# Altium schematic sheet CF_ESP32_S3_CAM_BOARD.SchDoc
size A3
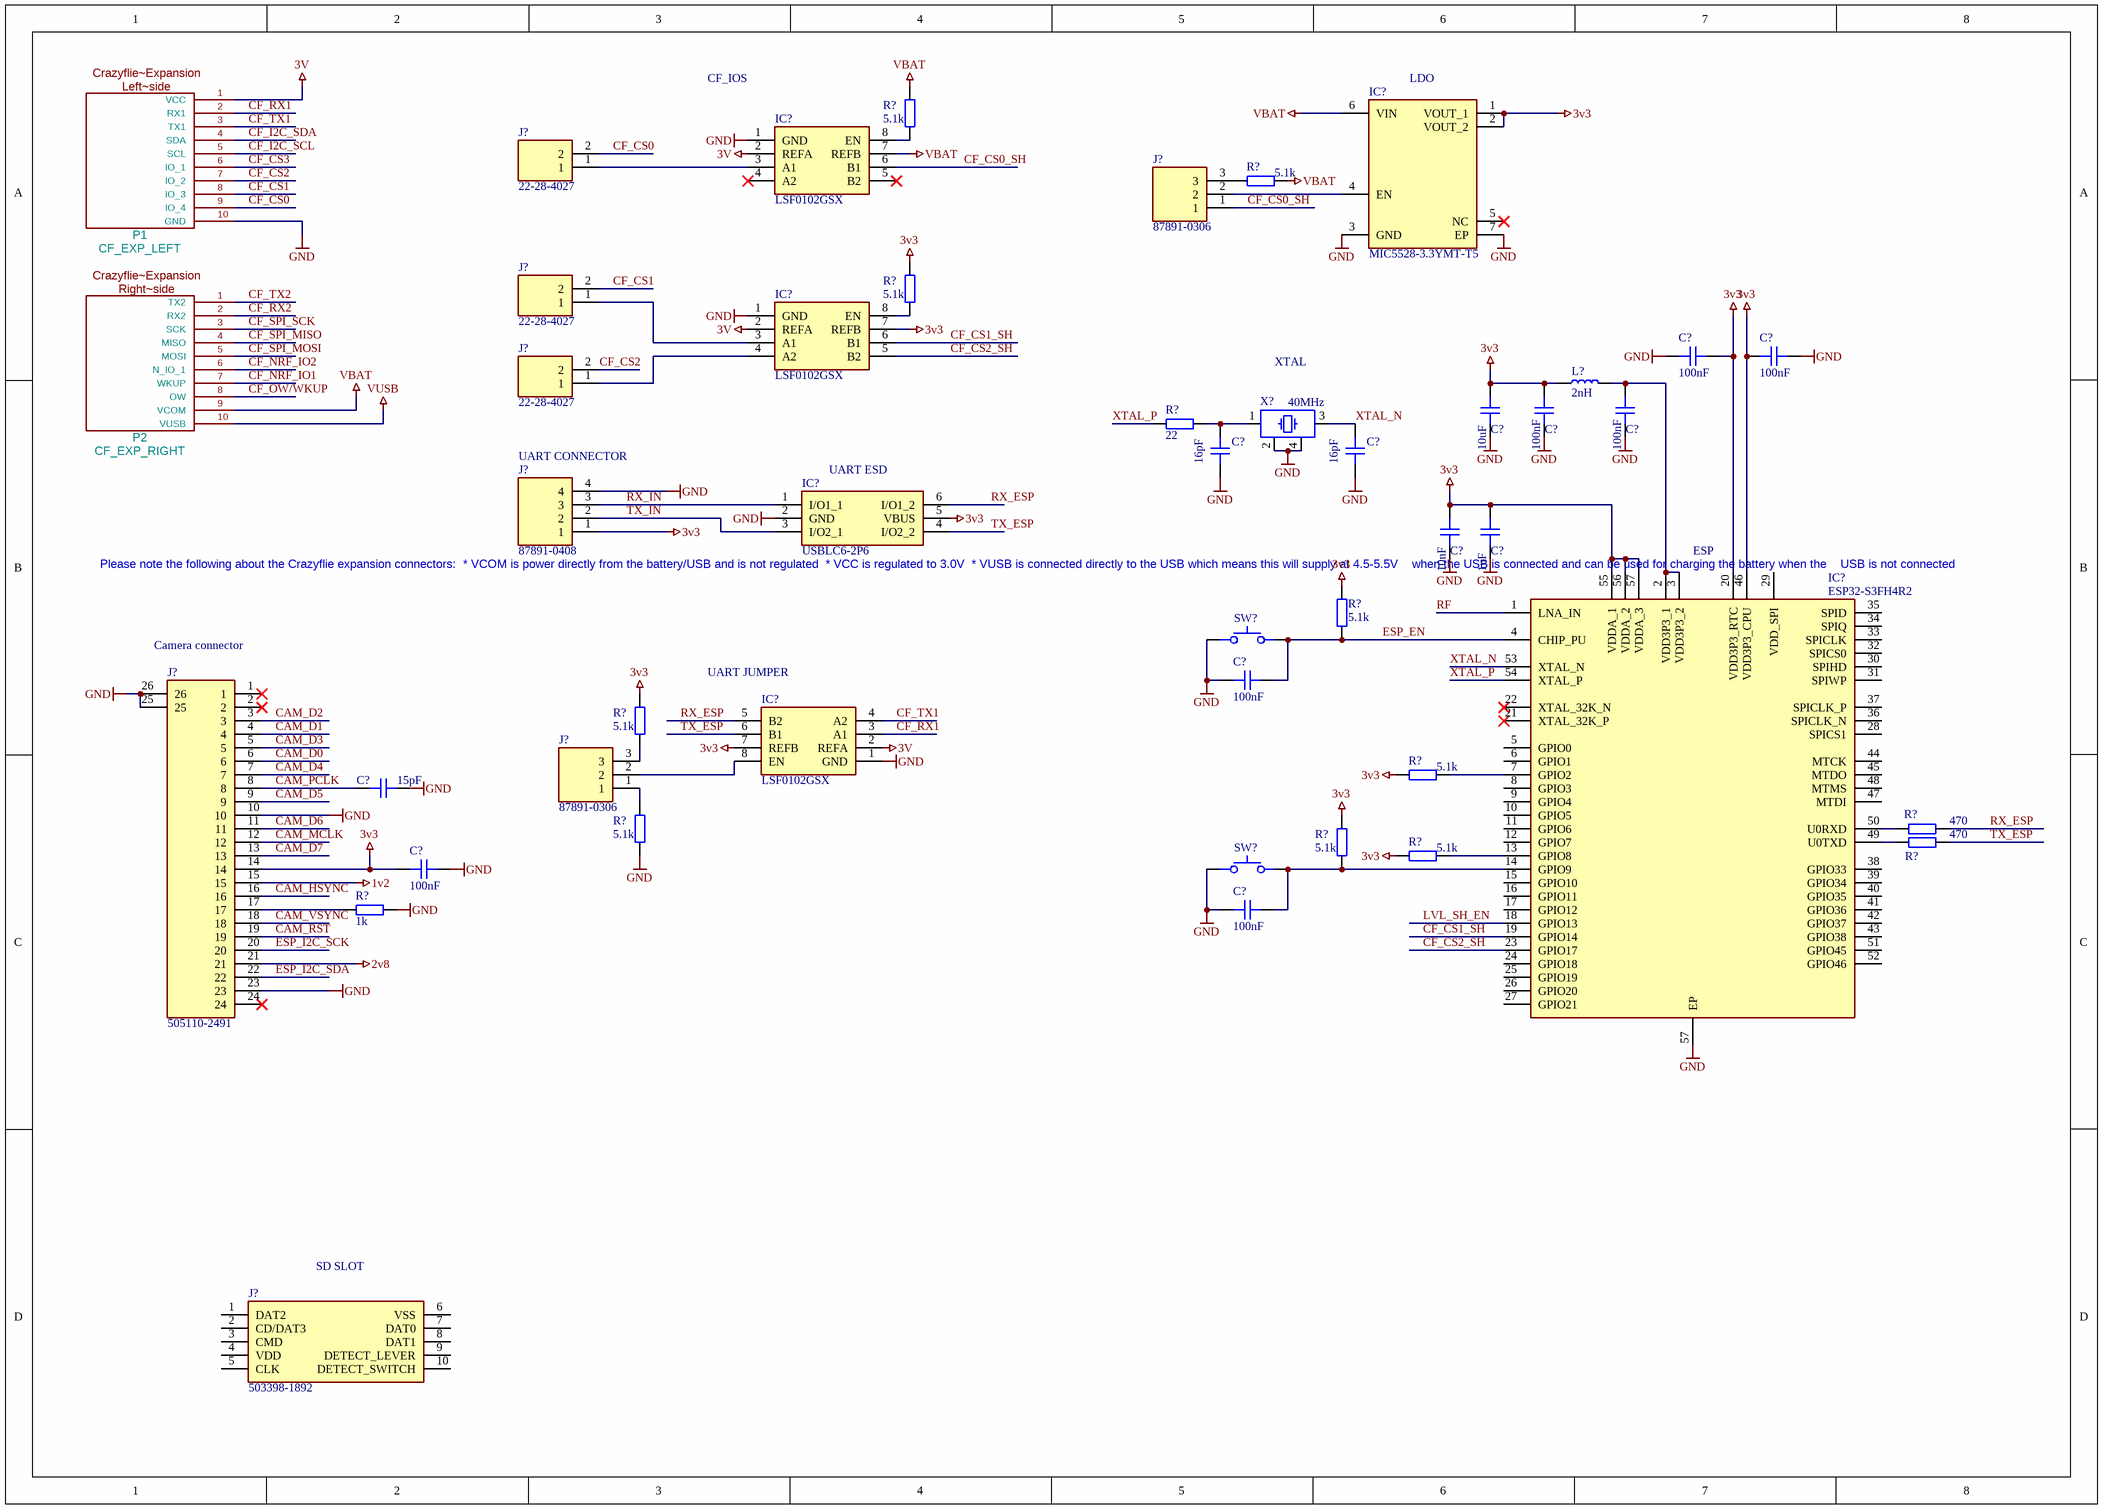
[diagram p0: CF_ESP32_S3_CAM_BOARD.SchDoc]

## Parts
(Parts that share a designator on the sheet are numbered #1, #2 ... from top to bottom, then left to right.)
C?#1  value 100nF  [CAP_0402]  (hidden comment: C0402_10V)
C?#2  value 100nF  [CAP_0402]  (hidden comment: C0402_10V)
C?#3  value 10uF  [CAP_0402]  (hidden comment: C0402_10V)
C?#4  value 100nF  [CAP_0402]  (hidden comment: C0402_10V)
C?#5  value 100nF  [CAP_0402]  (hidden comment: C0402_10V)
C?#6  value 16pF  [CAP_0402]  (hidden comment: C0402_10V)
C?#7  value 16pF  [CAP_0402]  (hidden comment: C0402_10V)
C?#8  value 10nF  [CAP_0402]  (hidden comment: C0402_10V)
C?#9  value 1uF  [CAP_0402]  (hidden comment: C0402_10V)
C?#10  value 100nF  [CAP_0402]  (hidden comment: C0402_10V)
C?#11  value 15pF  [CAP_0402]  (hidden comment: C0402_10V)
C?#12  value 100nF  [CAP_0402]  (hidden comment: C0402_10V)
C?#13  value 100nF  [CAP_0402]  (hidden comment: C0402_10V)
IC?#1  MIC5528-3.3YMT-T5  [SON40P120X120X60-7N-D]
IC?#2  LSF0102GSX  [LSF0102GSX]
IC?#3  LSF0102GSX  [LSF0102GSX]
IC?#4  USBLC6-2P6  [USBLC62P6]
IC?#5  ESP32-S3FH4R2  [QFN40P700X700X90-57N-D]
IC?#6  LSF0102GSX  [LSF0102GSX]
J?#1  22-28-4027  [HDRV2W66P0X254_1X2_508X249X1067P]
J?#2  87891-0306  [HDRV3W69P0X254_1X3_762X251X853P]
J?#3  22-28-4027  [HDRV2W66P0X254_1X2_508X249X1067P]
J?#4  22-28-4027  [HDRV2W66P0X254_1X2_508X249X1067P]
J?#5  87891-0408  [HDRV4W69P0X254_1X4_1016X251X2823P]
J?#6  505110-2491  [5051102491]
J?#7  87891-0306  [HDRV3W69P0X254_1X3_762X251X853P]
J?#8  503398-1892  [503398-1892]
L?  value 2nH  [IND_0402]  (hidden comment: L0402)
P1  CF_EXP_LEFT
P2  CF_EXP_RIGHT
R?#1  value 5.1k  [RES_0402]  (hidden comment: R0402)
R?#2  value 5.1k  [RES_0402]  (hidden comment: R0402)
R?#3  value 5.1k  [RES_0402]  (hidden comment: R0402)
R?#4  value 22  [RES_0402]  (hidden comment: R0402)
R?#5  value 5.1k  [RES_0402]  (hidden comment: R0402)
R?#6  value 5.1k  [RES_0402]  (hidden comment: R0402)
R?#7  value 5.1k  [RES_0402]  (hidden comment: R0402)
R?#8  value 5.1k  [RES_0402]  (hidden comment: R0402)
R?#9  value 470  [RES_0402]  (hidden comment: R0402)
R?#10  value 5.1k  [RES_0402]  (hidden comment: R0402)
R?#11  value 470  [RES_0402]  (hidden comment: R0402)
R?#12  value 5.1k  [RES_0402]  (hidden comment: R0402)
R?#13  value 1k  [RES_0402]  (hidden comment: R0402)
SW?#1  SKRPANE010  [SKRPANE010]  (value not drawn)
SW?#2  SKRPANE010  [SKRPANE010]  (value not drawn)
X?  40MHz  [XTAL_2520]

## Nets
1v2: J?#6.15
2v8: J?#6.21
3V: IC?#2.2(REFA) IC?#3.2(REFA) IC?#6.2(REFA) P1.1(VCC)
3v3: C?#1.1 C?#2.2 C?#3.2 C?#4.2 C?#8.2 C?#9.1 C?#12.2 IC?#1.1(VOUT_1) IC?#1.2(VOUT_2) IC?#3.7(REFB) IC?#4.5(VBUS) IC?#5.20(VDD3P3_RTC) IC?#5.46(VDD3P3_CPU) IC?#5.55(VDDA_1) IC?#5.56(VDDA_2) IC?#5.57(VDDA_3) IC?#6.7(REFB) J?#5.1 J?#6.14 L?.1 R?#3.2 R?#5.2 R?#6.2 R?#7.1 R?#10.2 R?#12.1
GND: C?#1.2 C?#2.1 C?#3.1 C?#4.1 C?#5.1 C?#6.1 C?#7.1 C?#8.1 C?#9.2 C?#10.2 C?#11.1 C?#12.1 C?#13.2 IC?#1.3(GND) IC?#1.7(EP) IC?#2.1(GND) IC?#3.1(GND) IC?#4.2(GND) IC?#5.57(EP) IC?#6.1(GND) J?#5.4 J?#6.10 J?#6.23 J?#6.25 J?#6.26 P1.10(GND) R?#8.1 R?#13.1 SW?#1.12 SW?#2.12 X?.2 X?.4
VBAT: IC?#1.6(VIN) IC?#2.7(REFB) P2.9(VCOM) R?#1.2 R?#2.2
VUSB: P2.10(VUSB)
CAM_D0: J?#6.6
CAM_D1: J?#6.4
CAM_D2: J?#6.3
CAM_D3: J?#6.5
CAM_D4: J?#6.7
CAM_D5: J?#6.9
CAM_D6: J?#6.11
CAM_D7: J?#6.13
CAM_HSYNC: J?#6.16
CAM_MCLK: J?#6.12
CAM_PCLK: C?#11.2 J?#6.8
CAM_RST: J?#6.19
CAM_VSYNC: J?#6.18
CF_CS0: J?#1.2 P1.9(IO_4)
CF_CS0_SH: IC?#2.6(B1) J?#2.1
CF_CS1: J?#3.2 P1.8(IO_3)
CF_CS1_SH: IC?#3.6(B1) IC?#5.19(GPIO14)
CF_CS2: J?#4.2 P1.7(IO_2)
CF_CS2_SH: IC?#3.5(B2) IC?#5.23(GPIO17)
CF_CS3: P1.6(IO_1)
CF_I2C_SCL: P1.5(SCL)
CF_I2C_SDA: P1.4(SDA)
CF_NRF_IO1: P2.7(WKUP)
CF_NRF_IO2: P2.6(N_IO_1)
CF_OW/WKUP: P2.8(OW)
CF_RX1: IC?#6.3(A1) P1.2(RX1)
CF_RX2: P2.2(RX2)
CF_SPI_MISO: P2.4(MISO)
CF_SPI_MOSI: P2.5(MOSI)
CF_SPI_SCK: P2.3(SCK)
CF_TX1: IC?#6.4(A2) P1.3(TX1)
CF_TX2: P2.1(TX2)
ESP_EN: C?#10.1 IC?#5.4(CHIP_PU) R?#5.1 SW?#1.34
ESP_I2C_SCK: J?#6.20
ESP_I2C_SDA: J?#6.22
LVL_SH_EN: IC?#5.18(GPIO13)
RF: IC?#5.1(LNA_IN)
RX_ESP: IC?#4.6(I/O1_2) IC?#6.5(B2) R?#9.1
RX_IN: IC?#4.1(I/O1_1) J?#5.3
TX_ESP: IC?#4.4(I/O2_2) IC?#6.6(B1) R?#11.1
TX_IN: IC?#4.3(I/O2_1) J?#5.2
XTAL_N: C?#7.2 IC?#5.53(XTAL_N) X?.3
XTAL_P: IC?#5.54(XTAL_P) R?#4.1
NetC?#5_2: C?#5.2 IC?#5.2(VDD3P3_1) IC?#5.3(VDD3P3_2) L?.2
NetC?#6_2: C?#6.2 R?#4.2 X?.1
NetC?#13_1: C?#13.1 IC?#5.14(GPIO9) R?#10.1 SW?#2.34
NetIC?#1_4: IC?#1.4(EN) J?#2.2
NetIC?#2_3: IC?#2.3(A1) J?#1.1
NetIC?#2_8: IC?#2.8(EN) R?#1.1
NetIC?#3_3: IC?#3.3(A1) J?#3.1
NetIC?#3_4: IC?#3.4(A2) J?#4.1
NetIC?#3_8: IC?#3.8(EN) R?#3.1
NetIC?#5_7: IC?#5.7(GPIO2) R?#7.2
NetIC?#5_13: IC?#5.13(GPIO8) R?#12.2
NetIC?#5_49: IC?#5.49(U0TXD) R?#11.2
NetIC?#5_50: IC?#5.50(U0RXD) R?#9.2
NetIC?#6_8: IC?#6.8(EN) J?#7.2
NetJ?#2_3: J?#2.3 R?#2.1
NetJ?#6_17: J?#6.17 R?#13.2
NetJ?#7_1: J?#7.1 R?#8.2
NetJ?#7_3: J?#7.3 R?#6.1

Not connected (* = marked no-connect by the designer): IC?#1 5(NC)*; IC?#2 4(A2)* 5(B2)*; IC?#5 5(GPIO0) 6(GPIO1) 8(GPIO3) 9(GPIO4) 10(GPIO5) 11(GPIO6) 12(GPIO7) 15(GPIO10) 16(GPIO11) 17(GPIO12) 21(XTAL_32K_P)* 22(XTAL_32K_N)* 24(GPIO18) 25(GPIO19) 26(GPIO20) 27(GPIO21) 28(SPICS1) 29(VDD_SPI) 30(SPIHD) 31(SPIWP) 32(SPICS0) 33(SPICLK) 34(SPIQ) 35(SPID) 36(SPICLK_N) 37(SPICLK_P) 38(GPIO33) 39(GPIO34) 40(GPIO35) 41(GPIO36) 42(GPIO37) 43(GPIO38) 44(MTCK) 45(MTDO) 47(MTDI) 48(MTMS) 51(GPIO45) 52(GPIO46); J?#6 1* 2* 24*; J?#8 1(DAT2) 2(CD/DAT3) 3(CMD) 4(VDD) 5(CLK) 6(VSS) 7(DAT0) 8(DAT1) 9(DETECT_LEVER) 10(DETECT_SWITCH)

## Notes on the sheet
- CF_IOS
- (near IC?#1) LDO
- XTAL
- (near J?#5) UART CONNECTOR
- (near IC?#4) UART ESD
- (near C?#9) Please note the following about the Crazyflie expansion connectors:
  * VCOM is power directly from the battery/USB and is not regulated
  * VCC is regulated to 3.0V
  * VUSB is connected directly to the USB which means this will supply at 4.5-5.5V
  when the USB is connected and can be used for charging the battery when the
  USB is not connected
- (near IC?#5) ESP
- (near J?#6) Camera connector
- (near IC?#6) UART JUMPER
- (near J?#8) SD SLOT
- Title:
- Drawn By:
- Checked By:
- Size:
- Date:
- A4
- Number:
- Sheet
- Revision:
- of
- (in symbol CF_EXP_LEFT) Crazyflie~Expansion; Left~side
- (in symbol CF_EXP_RIGHT) Crazyflie~Expansion; Right~side

## Library data of the parts
C?#1-C?#13 = CAP_0402_10V: Capacitor SMD 0402 10V
IC?#1 = MIC5528-3.3YMT-T5: LDO 3v3 500mA; Manufacturer_Name: Microchip; Datasheet Link: https://nl.mouser.com/datasheet/2/268/MIC5528_High_Performance_500mA_LDO_in_Thin_and_Ext-1891284.pdf; Height: 0.6mm; Manufacturer_Part_Number: MIC5528-3.3YMT-T5; Mouser Part Number: 998-MIC5528-3.3YMTT5; Mouser Price/Stock: https://www.mouser.co.uk/ProductDetail/Microchip-Technology/MIC5528-3.3YMT-T5?qs=U6T8BxXiZAUrsVLummtswg%3D%3D; Arrow Part Number: MIC5528-3.3YMT-T5; Arrow Price/Stock: https://www.arrow.com/en/products/mic5528-3.3ymt-t5/microchip-technology?region=nac
IC?#2 IC?#3 IC?#6 = LSF0102GSX: Integrated Circuit; Manufacturer_Name: Nexperia; Datasheet Link: https://componentsearchengine.com/Datasheets/2/LSF0102GSX.pdf; Height: 0.35mm; Manufacturer_Part_Number: LSF0102GSX; Mouser Part Number: 771-LSF0102GSX; Mouser Price/Stock: https://www.mouser.co.uk/ProductDetail/Nexperia/LSF0102GSX?qs=hWgE7mdIu5TvI233CGE%2FQA%3D%3D; Arrow Part Number: LSF0102GSX; Arrow Price/Stock: https://www.arrow.com/en/products/lsf0102gsx/nexperia?region=nac
IC?#4 = USBLC6-2P6: Integrated Circuit; Manufacturer_Name: STMicroelectronics; Datasheet Link: https://datasheet.lcsc.com/szlcsc/STMicroelectronics-USBLC6-2P6_C15999.pdf; Height: 0.6mm; Manufacturer_Part_Number: USBLC6-2P6; Mouser Part Number: 511-USBLC6-2P6; Mouser Price/Stock: https://www.mouser.co.uk/ProductDetail/STMicroelectronics/USBLC6-2P6?qs=6ARB0lp6jlViGcbUSvj1Mw%3D%3D; Arrow Part Number: USBLC6-2P6; Arrow Price/Stock: https://www.arrow.com/en/products/usblc6-2p6/stmicroelectronics?region=nac
IC?#5 = ESP32-S3FH4R2: Integrated Circuit; Manufacturer_Name: Espressif Systems; Datasheet Link: https://eu.mouser.com/datasheet/2/891/esp32_s3_datasheet_en-2946743.pdf; Height: 0.9mm; Manufacturer_Part_Number: ESP32-S3FH4R2; Mouser Part Number: 356-ESP32-S3FH4R2; Mouser Price/Stock: https://www.mouser.co.uk/ProductDetail/Espressif-Systems/ESP32-S3FH4R2?qs=tlsG%2FOw5FFjPrwkmZSBQNA%3D%3D
J?#1 J?#3 J?#4 = 22-28-4027: Connector; Manufacturer_Name: Molex; Datasheet Link: https://rs.componentsearchengine.com/Datasheets/1/22-28-4027.pdf; Height: 10.67mm; Manufacturer_Part_Number: 22-28-4027; Mouser Part Number: 538-22-28-4027; Mouser Price/Stock: https://www.mouser.co.uk/ProductDetail/Molex/22-28-4027?qs=MuwpYaHj750%2FJoCgIA915Q%3D%3D
J?#2 J?#7 = 87891-0306: Connector; Manufacturer_Name: Molex; Datasheet Link: https://componentsearchengine.com/Datasheets/2/87891-0306.pdf; Height: 8.53mm; Manufacturer_Part_Number: 87891-0306; Mouser Part Number: 538-87891-0306; Mouser Price/Stock: https://www.mouser.co.uk/ProductDetail/Molex/87891-0306?qs=kNSQ05%252BLZoBTQeB3Q30X0A%3D%3D
J?#5 = 87891-0408: Connector; Manufacturer_Name: Molex; Datasheet Link: https://tools.molex.com/pdm_docs/sd/878910408_sd.pdf; Height: 28.23mm; Manufacturer_Part_Number: 87891-0408; Mouser Part Number: 538-87891-0408; Mouser Price/Stock: https://www.mouser.com/Search/Refine.aspx?Keyword=538-87891-0408
J?#6 = 505110-2491: Connector; Manufacturer_Name: Molex; Datasheet Link: https://www.molex.com/pdm_docs/sd/5051102491_sd.pdf; Height: 4.06mm; Manufacturer_Part_Number: 505110-2491; Mouser Part Number: 538-505110-2491; Mouser Price/Stock: https://www.mouser.co.uk/ProductDetail/Molex/505110-2491?qs=fSIr1QPo%2F%2FQZaS1NuXTizw%3D%3D
J?#8 = 503398-1892: Connector; Manufacturer_Name: Molex; Datasheet Link: http://www.molex.com/webdocs/datasheets/pdf/en-us//5033981892_MEMORY_CARD_SOCKET.pdf; Manufacturer_Part_Number: 503398-1892; Mouser Part Number: 538-503398-1892; Mouser Price/Stock: https://www.mouser.co.uk/ProductDetail/Molex/503398-1892?qs=b0v8CoHHvSMxV%252BW12iKaSg%3D%3D
L? = IND_0402: Inductor SMD 0402
R?#1-R?#13 = RES_0402: Resistor SMD 0402; Manufacturer: *; Manufacturer Part Number: *; Distributor Link: *
SW?#1 SW?#2 = SKRPANE010: Tactile Switch SMD SPST; Manufacturer: Alps Alpine; Manufacturer Part Number: SKRPANE010
X? = XTAL_2520: Crystal SMD 2520; Distributor Link: *
P1 = CF_EXP_LEFT: Value: CF_EXP_LEFT
P2 = CF_EXP_RIGHT: Value: CF_EXP_RIGHT